# Altium schematic sheet Main.SchDoc
size 152 x 127 mm; SheetNumber: 1
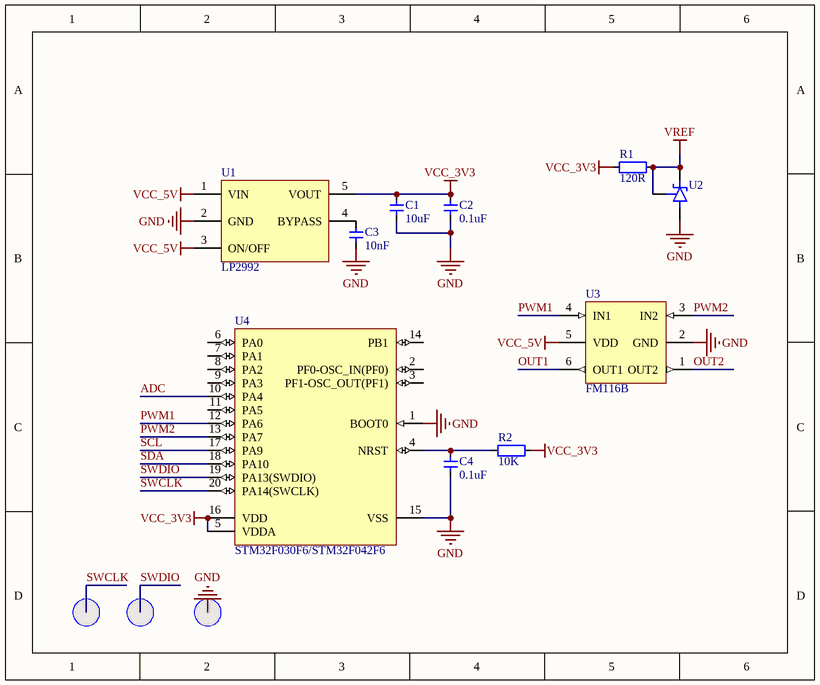
[diagram p0: Main.SchDoc]

## Parts
C1  10uF  [CAP_0402]
C2  0.1uF  [CAP_0402]
C3  10nF  [CAP_0402]
C4  0.1uF  [CAP_0402]
R1  120R  [RES_0402]
R2  10K  [RES_0402]
T1  测试点  [TEST_PT]  (value not drawn)
T2  测试点  [TEST_PT]  (value not drawn)
T3  测试点  [TEST_PT]  (value not drawn)
U1  LP2992  [SOT23-5]
U2  TL431IDBZT  [SOT23-3]  (value not drawn)
U3  FM116B  [SOT23-6]
U4  STM32F030F6/STM32F042F6  [TSSOP-20]

## Nets
GND: C1.1 C2.1 C3.2 C4.1 T3.0 U1.2(GND) U2.3(ANODE) U3.2(GND) U4.1(BOOT0) U4.15(VSS)
VCC_3V3: C1.2 C2.2 R1.1 R2.1 U1.5(VOUT) U4.5(VDDA) U4.16(VDD)
VCC_5V: U1.1(VIN) U1.3(ON/OFF) U3.5(VDD)
VREF: R1.2 U2.1(CATHODE) U2.2(REF)
ADC: U4.10(PA4)
OUT1: U3.6(OUT1)
OUT2: U3.1(OUT2)
PWM1: U3.4(IN1) U4.12(PA6)
PWM2: U3.3(IN2) U4.13(PA7)
SCL: U4.17(PA9)
SDA: U4.18(PA10)
SWCLK: T1.0 U4.20(PA14(SWCLK))
SWDIO: T2.0 U4.19(PA13(SWDIO))
NetC3_1: C3.1 U1.4(BYPASS)
NetC4_2: C4.2 R2.2 U4.4(NRST)

Not connected (* = marked no-connect by the designer): U4 2(PF0-OSC_IN(PF0)) 3(PF1-OSC_OUT(PF1)) 6(PA0) 7(PA1) 8(PA2) 9(PA3) 11(PA5) 14(PB1)

## Library data of the parts
C1-C4 = 电容-0402: Capacitor; Value: 0.1u
R1 R2 = 电阻-0402: Resistor; Value: 22R
U1 = LP2992: LDO
U2 = TL431IDBZT: Adjustable precision shunt regulator 3-SOT-23 -40 to 85; MF: Texas Instruments; Price: None; Package: SOT-23-3 Texas Instruments; Check_prices: https://www.snapeda.com/parts/TL431IDBZT/Texas%20Instruments/view-part/1206577/?ref=eda; Availability: Warning; MP: TL431IDBZT; Value: *; SnapEDA_Link: https://www.snapeda.com/parts/TL431IDBZT/Texas%20Instruments/view-part/1206577/?ref=snap; Purchase-URL: https://pricing.snapeda.com/search/part/TL431IDBZT/?ref=eda
U3 = FM116B: PartNumber: 24LC256-I/ST; Code_JEDEC: MO-153; PackageVersion: revBB, Aug-2009; PackageReference: TSSOP-ST8; PackageDescription: 8-Lead Plastic Thin Shrink Small Outline (ST) - 4.4mm Body [TSSOP]; DatasheetVersion: revP, Oct-2007
U4 = STM32F030F4P6: ARM Cortex-M0 32-bit MCU, 16 KB Flash, 4 KB Internal RAM, 15 I/Os, 20-pin TSSOP, -40 to 85 degC, Tube; FLASH Size (Prog) (kB): 16; I/Os (High Current): 15; Internal RAM Size (kB): 4; Operating Frequency(F) (Processor speed) (MHz): 48; Supply Voltage(Vcc) min (V): 2.4; DatasheetVersion: Rev. 1; PackageVersion: Rev. 1, 11/2012; PackageReference: TSSOP20; PackageDescription: 20-Pin Thin Shrink Small Outline Package, 6.5 x 4.4 mm Body, 0.65 mm Pitch; Supplier 1: Digi-Key; Supplier Part Number 1: 497-14044-5-ND; Supplier 2: Newark; Supplier Part Number 2: 06X3648; Supplier 3: Mouser; Supplier Part Number 3: 511-STM32F030F4P6; Core: ARM Cortex-M0; Packing: Tube; Mounting Technology: Surface Mount; PartNumber: STM32F030F4P6; ComponentLink1Description: Manufacturer URL; ComponentLink1URL: http://www.st.com/web/en/home.html; ComponentLink2Description: Datasheet; ComponentLink2URL: http://www.st.com/st-web-ui/static/active/en/resource/technical/document/datasheet/DM00088500.pdf; ComponentLink3Description: Package Specification; ComponentLink3URL: http://www.st.com/st-web-ui/static/active/en/resource/technical/document/datasheet/DM00065136.pdf